# Altium schematic sheet Sheet1.SchDoc
size C
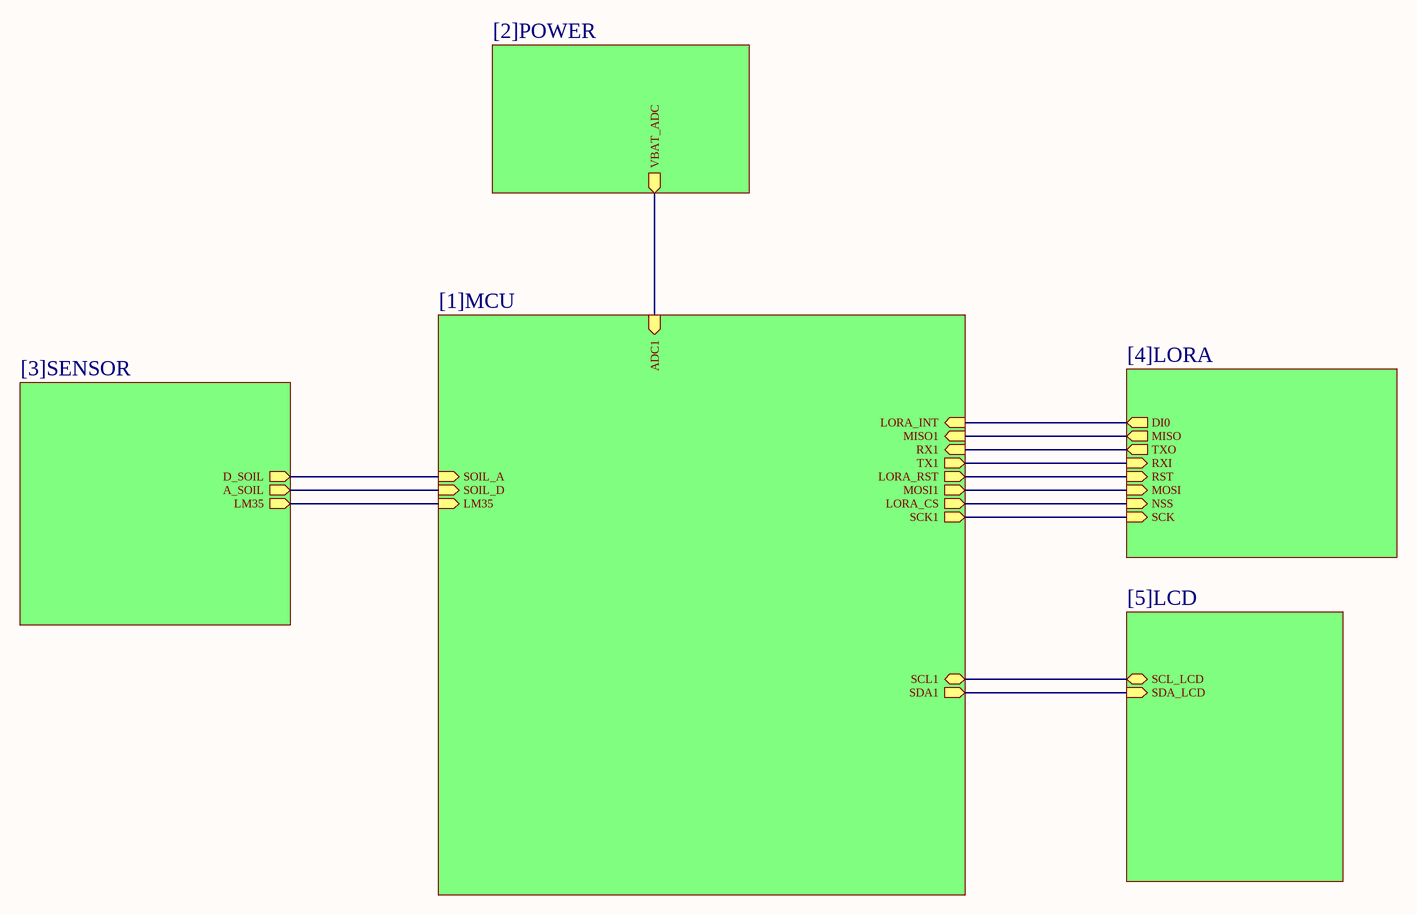
[diagram p0: Sheet1.SchDoc]

## Sub-sheets
LCD = [5]LCD: SDA_LCD (in), SCL_LCD (bidir)
LORA = [4]LORA: DI0 (out), MISO (out), TXO (out), RXI (in), RST (in), MOSI (in), NSS (in), SCK (in)
MCU = [1]MCU: TX1 (out), LORA_INT (in), MOSI1 (out), SCK1 (out), MISO1 (in), LM35 (in), LORA_CS (out), LORA_RST (out), ADC1 (in), SOIL_D (in), SOIL_A (in), RX1 (in), SCL1 (bidir), SDA1 (out)
POWER = [2]POWER: VBAT_ADC (out)
SENSOR = [3]SENSOR: D_SOIL (out), A_SOIL (out), LM35 (out)

## Nets
(unnamed): sheet MCU/TX1, sheet LORA/RXI
(unnamed): sheet MCU/LORA_INT, sheet LORA/DI0
(unnamed): sheet MCU/MOSI1, sheet LORA/MOSI
(unnamed): sheet MCU/SCK1, sheet LORA/SCK
(unnamed): sheet MCU/MISO1, sheet LORA/MISO
(unnamed): sheet MCU/LM35, sheet SENSOR/LM35
(unnamed): sheet MCU/LORA_CS, sheet LORA/NSS
(unnamed): sheet MCU/LORA_RST, sheet LORA/RST
(unnamed): sheet MCU/ADC1, sheet POWER/VBAT_ADC
(unnamed): sheet MCU/SOIL_D, sheet SENSOR/A_SOIL
(unnamed): sheet MCU/SOIL_A, sheet SENSOR/D_SOIL
(unnamed): sheet MCU/RX1, sheet LORA/TXO
(unnamed): sheet MCU/SCL1, sheet LCD/SCL_LCD
(unnamed): sheet MCU/SDA1, sheet LCD/SDA_LCD